# Altium schematic sheet GD32F103VET61_GD32F103VET6.schdoc
size 124 x 182 mm
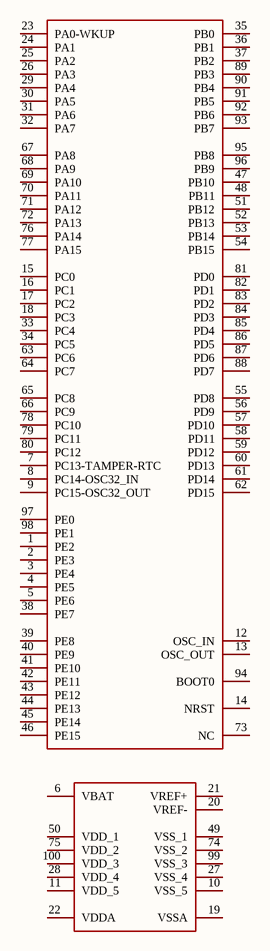
[diagram p0: GD32F103VET61_GD32F103VET6.schdoc]

## Parts
(Parts that share a designator on the sheet are numbered #1, #2 ... from top to bottom, then left to right.)
U?#1  GD32F103VET6  [LQFP-100_L14.0-W14.0-P0.50-LS16.0-BL]  (value not drawn)  (part A of 2)
U?#2  GD32F103VET6  [LQFP-100_L14.0-W14.0-P0.50-LS16.0-BL]  (value not drawn)  (part B of 2)

## Nets

Not connected (* = marked no-connect by the designer): U?#1 1(PE2) 2(PE3) 3(PE4) 4(PE5) 5(PE6) 7(PC13-TAMPER-RTC) 8(PC14-OSC32_IN) 9(PC15-OSC32_OUT) 12(OSC_IN) 13(OSC_OUT) 14(NRST) 15(PC0) 16(PC1) 17(PC2) 18(PC3) 23(PA0-WKUP) 24(PA1) 25(PA2) 26(PA3) 29(PA4) 30(PA5) 31(PA6) 32(PA7) 33(PC4) 34(PC5) 35(PB0) 36(PB1) 37(PB2) 38(PE7) 39(PE8) 40(PE9) 41(PE10) 42(PE11) 43(PE12) 44(PE13) 45(PE14) 46(PE15) 47(PB10) 48(PB11) 51(PB12) 52(PB13) 53(PB14) 54(PB15) 55(PD8) 56(PD9) 57(PD10) 58(PD11) 59(PD12) 60(PD13) 61(PD14) 62(PD15) 63(PC6) 64(PC7) 65(PC8) 66(PC9) 67(PA8) 68(PA9) 69(PA10) 70(PA11) 71(PA12) 72(PA13) 73(NC) 76(PA14) 77(PA15) 78(PC10) 79(PC11) 80(PC12) 81(PD0) 82(PD1) 83(PD2) 84(PD3) 85(PD4) 86(PD5) 87(PD6) 88(PD7) 89(PB3) 90(PB4) 91(PB5) 92(PB6) 93(PB7) 94(BOOT0) 95(PB8) 96(PB9) 97(PE0) 98(PE1); U?#2 6(VBAT) 10(VSS_5) 11(VDD_5) 19(VSSA) 20(VREF-) 21(VREF+) 22(VDDA) 27(VSS_4) 28(VDD_4) 49(VSS_1) 50(VDD_1) 74(VSS_2) 75(VDD_2) 99(VSS_3) 100(VDD_3)

## Library data of the parts
U?#1 U?#2 = GD32F103VET6: Manufacturer: GigaDevice(兆易创新); Add into BOM: yes; CPU Core: ARM-M3; CPU Maximum Speed: 108MHz; Program Storage Size: 512KB; Program Memory Type: FLASH; Number of I/O: 80; ADC (Bit): 12bit; PWM (Bit): 16bit; Voltage - Supply: 2.6V~3.6V; Symbol: GD32F103VET6; Device: GD32F103VET6; LCSC Part Name: Arm® Cortex®-M3 32-bit MCU; Supplier Part: C80215; Manufacturer Part: GD32F103VET6; Supplier Footprint: LQFP-100(14x14); JLCPCB Part Class: Extended Part; Datasheet: https://item.szlcsc.com/datasheet/GD32F103VET6/81360.html; Supplier: LCSC; Convert to PCB: yes; DAC (Bit): 12bit; Applications: -